# EAGLE design OttoPi02 (EAGLE 9.6.2)
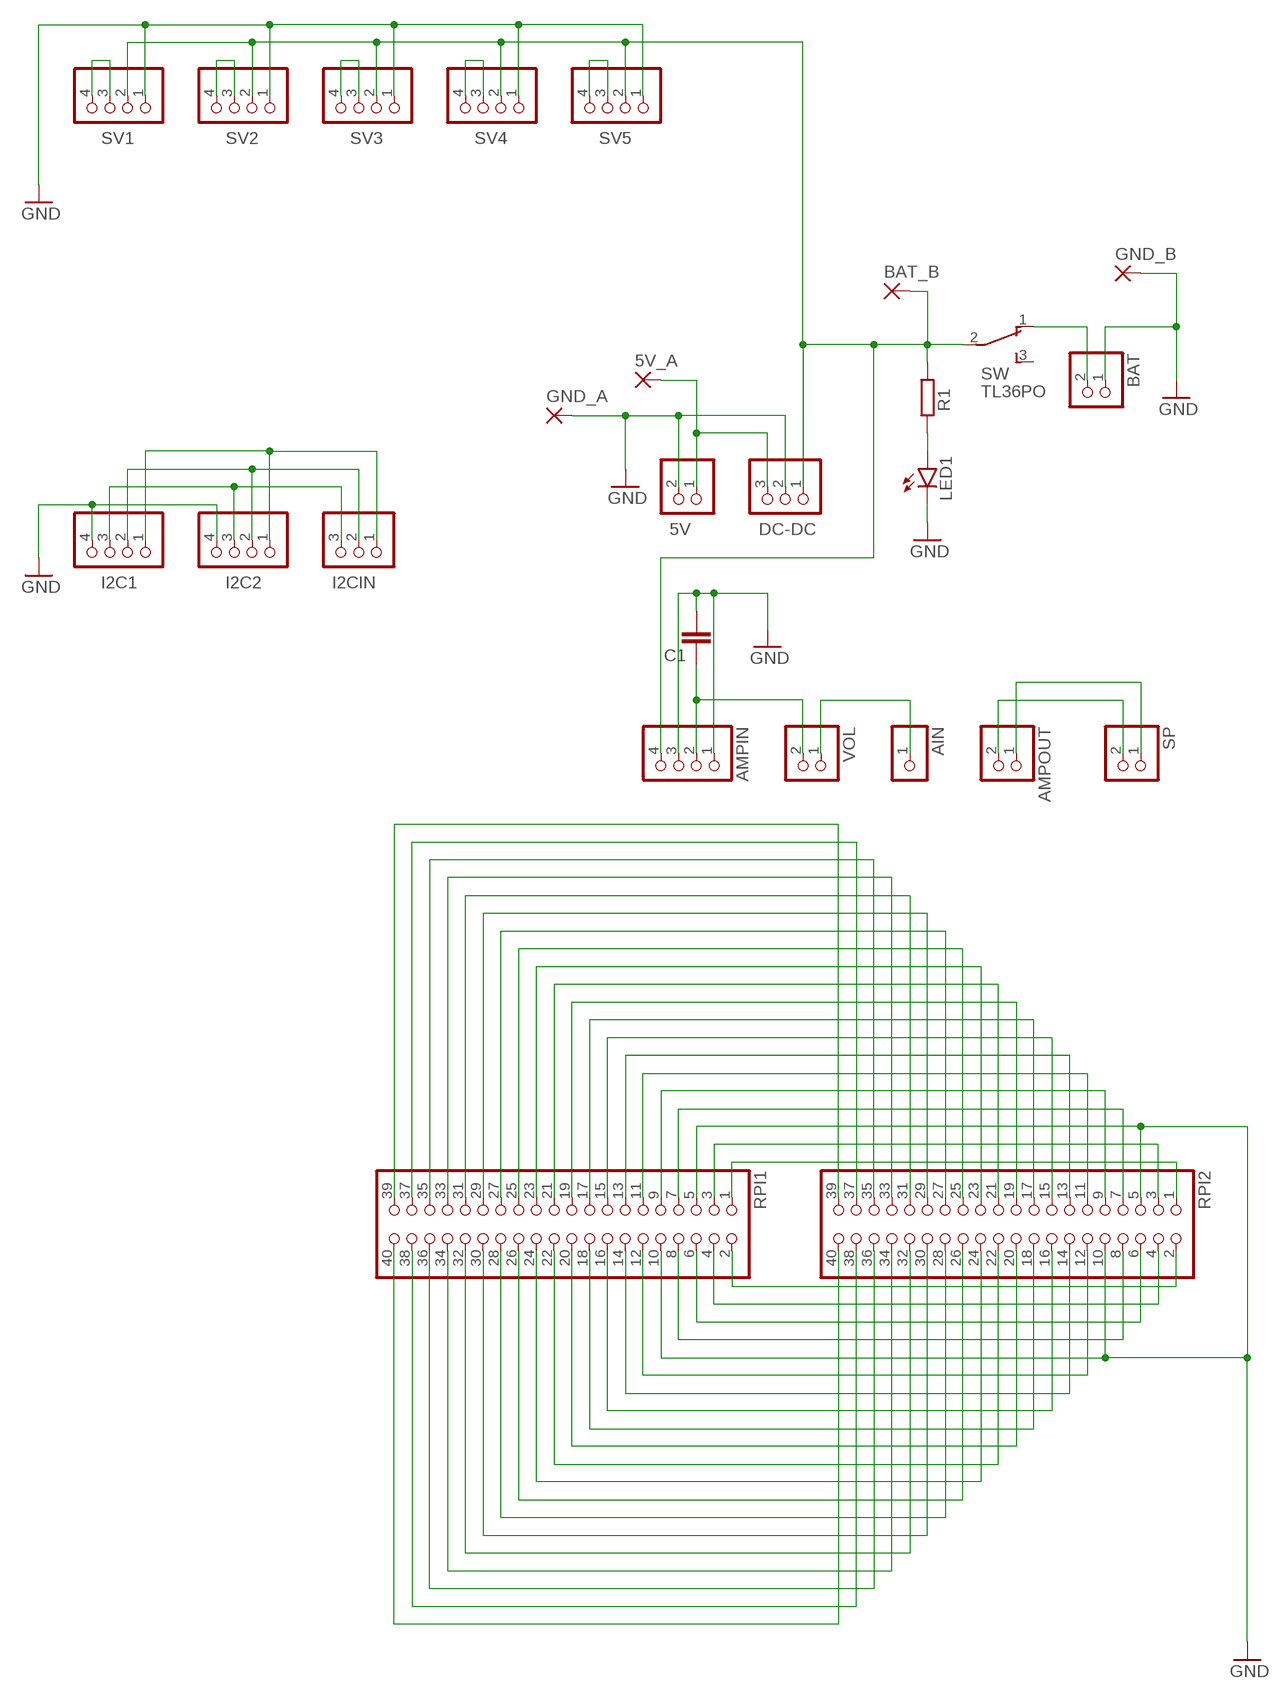
[diagram p0: schematic, sheet 1]

## Parts
5V  PINHD-1X2  [1X02]
5V_A  1,6/0,9  [1,6/0,9]
AIN  PINHD-1X1  [1X01]
AMPIN  PINHD-1X4  [1X04]
AMPOUT  PINHD-1X2  [1X02]
BAT  PINHD-1X2  [1X02]
BAT_B  1,6/0,9  [1,6/0,9]
C1  C-EU025-024X044  [C025-024X044]
DC-DC  PINHD-1X3  [1X03]
GND_A  1,6/0,9  [1,6/0,9]
GND_B  1,6/0,9  [1,6/0,9]
I2C1  PINHD-1X4  [1X04]
I2C2  PINHD-1X4  [1X04]
I2CIN  PINHD-1X3  [1X03]
LED1  LED3MM  [LED3MM]
R1  R-EU_0204/7  [0204/7]
RPI1  PINHD-2X20  [2X20]
RPI2  PINHD-2X20  [2X20]
SP  PINHD-1X2  [1X02]
SV1  PINHD-1X4  [1X04]
SV2  PINHD-1X4  [1X04]
SV3  PINHD-1X4  [1X04]
SV4  PINHD-1X4  [1X04]
SV5  PINHD-1X4  [1X04]
SW  TL36PO  [TL3XPO]
VOL  PINHD-1X2  [1X02]

## Nets
GND: 5V.2 AMPIN.1 AMPIN.3 BAT.1 C1.2 DC-DC.2 GND_A.1(P) GND_B.1(P) I2C1.4 I2C2.4 LED1.K(C) RPI1.5 RPI1.10 RPI2.5 RPI2.10 SV1.1 SV2.1 SV3.1 SV4.1 SV5.1
N$1: I2C1.1 I2C2.1 I2CIN.1
N$2: I2C1.2 I2C2.2 I2CIN.2
N$3: I2C1.3 I2C2.3 I2CIN.3
N$4: AMPOUT.2 SP.2
N$5: 5V.1 5V_A.1(P) DC-DC.3
N$6: SV1.3 SV1.4
N$7: BAT.2 SW.1(O)
N$8: AMPIN.2 C1.1 VOL.2
N$9: SV2.3 SV2.4
N$10: SV3.3 SV3.4
N$11: SV4.3 SV4.4
N$12: AMPOUT.1 SP.1
N$13: AMPIN.4 BAT_B.1(P) DC-DC.1 R1.2 SV1.2 SV2.2 SV3.2 SV4.2 SV5.2 SW.2(P)
N$14: AIN.1 VOL.1
N$15: LED1.A R1.1
N$16: RPI1.1 RPI2.1
N$17: RPI1.3 RPI2.3
N$19: RPI1.7 RPI2.7
N$20: RPI1.9 RPI2.9
N$21: RPI1.11 RPI2.11
N$22: RPI1.13 RPI2.13
N$23: RPI1.15 RPI2.15
N$24: RPI1.17 RPI2.17
N$25: RPI1.19 RPI2.19
N$26: RPI1.21 RPI2.21
N$27: RPI1.23 RPI2.23
N$28: RPI1.25 RPI2.25
N$29: RPI1.27 RPI2.27
N$30: RPI1.29 RPI2.29
N$31: RPI1.31 RPI2.31
N$32: RPI1.33 RPI2.33
N$33: RPI1.35 RPI2.35
N$34: RPI1.37 RPI2.37
N$35: RPI1.39 RPI2.39
N$36: RPI1.2 RPI2.2
N$37: RPI1.4 RPI2.4
N$38: RPI1.6 RPI2.6
N$39: RPI1.8 RPI2.8
N$40: SV5.3 SV5.4
N$41: RPI1.12 RPI2.12
N$42: RPI1.14 RPI2.14
N$43: RPI1.16 RPI2.16
N$44: RPI1.18 RPI2.18
N$45: RPI1.20 RPI2.20
N$46: RPI1.22 RPI2.22
N$47: RPI1.24 RPI2.24
N$48: RPI1.26 RPI2.26
N$49: RPI1.28 RPI2.28
N$50: RPI1.30 RPI2.30
N$51: RPI1.32 RPI2.32
N$52: RPI1.34 RPI2.34
N$53: RPI1.36 RPI2.36
N$54: RPI1.38 RPI2.38
N$55: RPI1.40 RPI2.40
Unconnected: SW.3(S)

## Library data of the parts
5V AMPOUT BAT SP VOL = pinhead:PINHD-1X2: PIN HEADER
5V_A BAT_B GND_A GND_B = wirepad:1,6/0,9: THROUGH-HOLE PAD
AIN = pinhead:PINHD-1X1: PIN HEADER
AMPIN I2C1 I2C2 SV1-SV5 = pinhead:PINHD-1X4: PIN HEADER
C1 = rcl:C-EU: CAPACITOR, European symbol; SPICEPREFIX: C
DC-DC I2CIN = pinhead:PINHD-1X3: PIN HEADER
LED1 = led:LED: LED OSRAM: - CHIPLED LG R971, LG N971, LY N971, LG Q971, LY Q971, LO R971, LY R971 LH N974, LH R974 LS Q976, LO Q976, LY Q976 LO Q996 - Hyper CHIPLED LW Q18S LB Q993, LB Q99A, LB R99A - SideLED LS A670, LO A670, LY A670, LG A670, LP A670 LB A673, LV A673, LT A673, LW A673 LH A674 LY A675 LS A676, LA A676, LO A676, LY A676, LW A676 LS A679, LY A679, LG A679 - Hyper Micro SIDELED® LS Y876, LA Y876, LO Y876, LY Y876 LT Y87S - SmartLED LW L88C, LW L88S LB L89C, LB L89S, LG L890 LS L89K, LO L89K, LY L89K LS L896, LA L896, LO L896, LY L896 - TOPLED LS T670, LO T670, LY T670, LG T670, LP T670 LSG T670, LSP T670, LSY T670, LOP T670, LYG T670 LG T671, LOG T671, LSG T671 LB T673, LV T673, LT T673, LW T673 LH T674 LS T676, LA T676, LO T676, LY T676, LB T676, LH T676, LSB T676, LW T676 LB T67C, LV T67C, LT T67C, LS T67K, LO T67K, LY T67K, LW E67C LS E67B, LA E67B, LO E67B, LY E67B, LB E67C, LV E67C, LT E67C LW T67C LS T679, LY T679, LG T679 LS T770, LO T770, LY T770, LG T770, LP T770 LB T773, LV T773, LT T773, LW T773 LH T774 LS E675, LA E675, LY E675, LS T675 LS T776, LA T776, LO T776, LY T776, LB T776 LHGB T686 LT T68C, LB T68C - Hyper Mini TOPLED® LB M676 - Mini TOPLED Santana® LG M470 LS M47K, LO M47K, LY M47K Source: http://www.osram.convergy.de LUXEON: - LUMILED® LXK2-PW12-R00, LXK2-PW12-S00, LXK2-PW14-U00, LXK2-PW14-V00 LXK2-PM12-R00, LXK2-PM12-S00, LXK2-PM14-U00 LXK2-PE12-Q00, LXK2-PE12-R00, LXK2-PE12-S00, LXK2-PE14-T00, LXK2-PE14-U00 LXK2-PB12-K00, LXK2-PB12-L00, LXK2-PB12-M00, LXK2-PB14-N00, LXK2-PB14-P00, LXK2-PB14-Q00 LXK2-PR12-L00, LXK2-PR12-M00, LXK2-PR14-Q00, LXK2-PR14-R00 LXK2-PD12-Q00, LXK2-PD12-R00, LXK2-PD12-S00 LXK2-PH12-R00, LXK2-PH12-S00 LXK2-PL12-P00, LXK2-PL12-Q00, LXK2-PL12-R00 Source: www.luxeon.com KINGBRIGHT: KA-3528ASYC Source: www.kingbright.com
R1 = rcl:R-EU_: RESISTOR, European symbol; SPICEPREFIX: R
RPI1 RPI2 = pinhead:PINHD-2X20: PIN HEADER
SW = switch:TL36PO: TINY SWITCH ON - ON Source: http://www2.produktinfo.conrad.com/datenblaetter/700000-724999/705152-da-01-de-Subminiaturschalter_TL_36YO.pdf

## Board
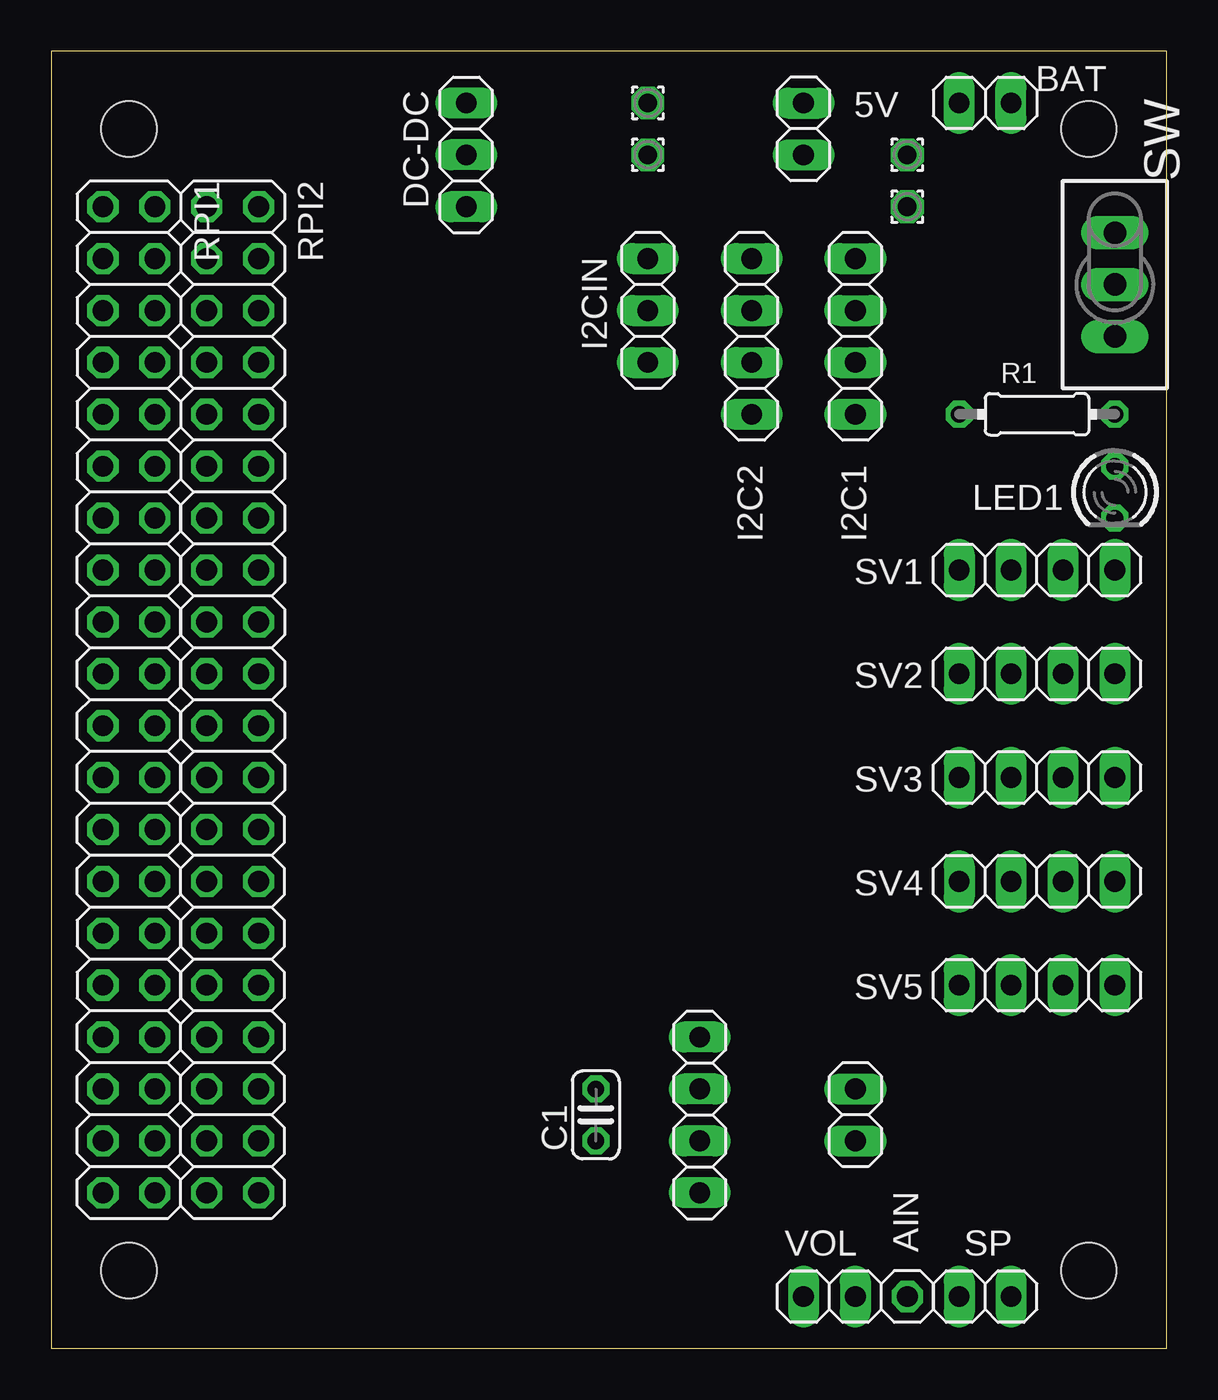
[diagram p1: board, top side]
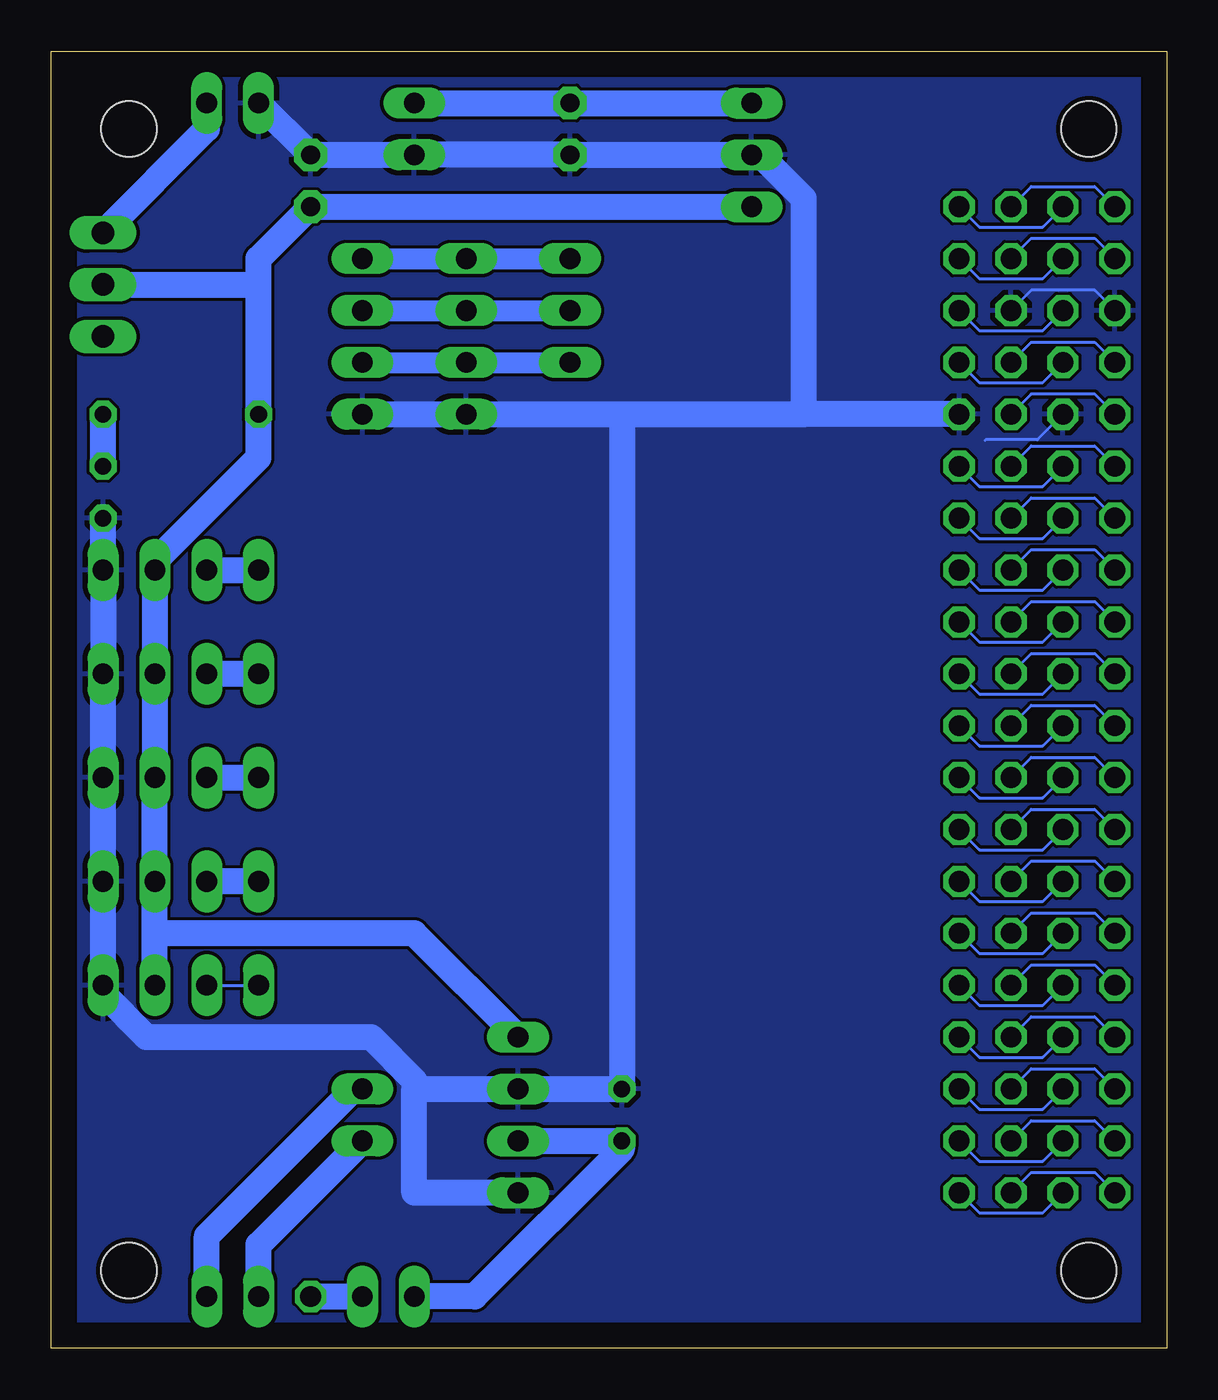
[diagram p2: board, bottom side, seen from below]

Size 54.61 x 63.5 mm. Coordinates in mm from the lower left corner, seen from the top.
Outline: 0,0 54.61,0 54.61,63.5 0,63.5 0,0
Copper layers (1*16): Top 0.035mm / dielectric 1.5mm / Bottom 0.035mm
Design rules "SeeedStudio_2layer_DRU_no_angle_20140221": minimum track width 6mil, minimum drill 12mil, track to track 6mil, track to pad 6mil, pad to pad 6mil, via to via 6mil, smd to smd 0mil, copper to edge 10mil, drill to drill 10mil, minimum pad ring 10mil, minimum via ring 6mil, stop-mask expansion 2mil, vias tented up to drill 100mil, thermal gap 10mil
Holes 2.7 mm at 3.81,3.81 50.8,3.81 3.81,59.69 50.8,59.69

### Footprints (pad centres in the part's own frame; a part is rotated, then mirrored left to right if it is on the bottom)
1X02 = drill 1.016 long: 1 -1.27,0; 2 1.27,0
1,6/0,9 = drill 0.914 pad 1.6 octagon: 1 0,0
1X01 = drill 1.016 octagon: 1 0,0
1X04 = drill 1.016 long: 1 -3.81,0; 2 -1.27,0; 3 1.27,0; 4 3.81,0
C025-024X044 = drill 0.813 octagon: 1 -1.27,0; 2 1.27,0
1X03 = drill 1.016 long: 1 -2.54,0; 2 0,0; 3 2.54,0
LED3MM = drill 0.813 octagon: A -1.27,0; K 1.27,0
0204/7 = drill 0.813 octagon: 1 -3.81,0; 2 3.81,0
2X20 = drill 1.016 octagon: 1 -24.13,-1.27; 2 -24.13,1.27; 3 -21.59,-1.27; 4 -21.59,1.27; 5 -19.05,-1.27; 6 -19.05,1.27; 7 -16.51,-1.27; 8 -16.51,1.27; 9 -13.97,-1.27; 10 -13.97,1.27; 11 -11.43,-1.27; 12 -11.43,1.27; 13 -8.89,-1.27; 14 -8.89,1.27; 15 -6.35,-1.27; 16 -6.35,1.27; 17 -3.81,-1.27; 18 -3.81,1.27; 19 -1.27,-1.27; 20 -1.27,1.27; 21 1.27,-1.27; 22 1.27,1.27; 23 3.81,-1.27; 24 3.81,1.27; 25 6.35,-1.27; 26 6.35,1.27; 27 8.89,-1.27; 28 8.89,1.27; 29 11.43,-1.27; 30 11.43,1.27; 31 13.97,-1.27; 32 13.97,1.27; 33 16.51,-1.27; 34 16.51,1.27; 35 19.05,-1.27; 36 19.05,1.27; 37 21.59,-1.27; 38 21.59,1.27; 39 24.13,-1.27; 40 24.13,1.27
TL3XPO = drill 1.1 pad 1.422 long: 1 -2.54,0; 2 0,0; 3 2.54,0

### Placement (x,y rotation side)
5V  36.83,59.69 270 top
5V_A  29.21,60.96 0 top
AIN  41.91,2.54 270 top
AMPIN  31.75,11.43 90 top
AMPOUT  39.37,11.43 270 top
BAT  45.72,60.96 0 top
BAT_B  41.91,55.88 0 top
C1  26.67,11.43 90 top
DC-DC  20.32,58.42 90 top
GND_A  29.21,58.42 0 top
GND_B  41.91,58.42 0 top
I2C1  39.37,49.53 270 top
I2C2  34.29,49.53 270 top
I2CIN  29.21,50.8 270 top
LED1  52.07,41.91 270 top
R1  48.26,45.72 180 top
RPI1  3.81,31.75 270 top
RPI2  8.89,31.75 270 top
SP  45.72,2.54 180 top
SV1  48.26,38.1 180 top
SV2  48.26,33.02 180 top
SV3  48.26,27.94 180 top
SV4  48.26,22.86 180 top
SV5  48.26,17.78 180 top
SW  52.07,52.07 270 top
VOL  38.1,2.54 180 top

### Tracks (layer width: path | path; a pad name or v marks a point on that pad's centre or on a via)
GND
  Bottom 0.152: RPI1.5 3.53,51.79 6.63,51.79 RPI2.5 | RPI1.10 6.32,44.48 6.35,44.48 8.87,44.48 8.89,44.45
  Bottom 1.27: 26.67,45.72 C1.2 AMPIN.3 36.83,12.7 | 26.67,45.72 17.78,45.72 | LED1.K SV1.1 SV2.1 SV3.1 SV4.1 SV5.1 52.07,17.37 49.94,15.24 38.96,15.24 36.83,13.11 36.83,12.7 | RPI2.10 17.78,45.72 | I2C1.4 I2C2.4 26.67,45.72 | AMPIN.1 36.83,7.62 36.83,12.7 | 17.78,45.72 17.78,56.29 19.91,58.42 DC-DC.2 GND_A.1 5V.2 GND_B.1 BAT.1
  pour Bottom: 1.27,62.23 1.27,1.27 53.34,1.27 53.34,62.23
N$1
  Bottom 1.016: I2CIN.1 I2C2.1 I2C1.1
N$2
  Bottom 1.016: I2CIN.2 I2C2.2 I2C1.2
N$3
  Bottom 1.016: I2CIN.3 I2C2.3 I2C1.3
N$4
  Bottom 1.27: SP.2 44.45,5.08 AMPOUT.2
N$5
  Bottom 1.27: 5V.1 5V_A.1 DC-DC.3
N$6
  Bottom 1.27: SV1.3 SV1.4
N$7
  Bottom 1.27: BAT.2 46.99,59.69 SW.1
N$8
  Bottom 1.27: AMPIN.2 C1.1 26.67,9.75 33.88,2.54 VOL.2
N$9
  Bottom 1.27: SV2.4 SV2.3
N$10
  Bottom 1.27: SV3.3 SV3.4
N$11
  Bottom 1.27: SV4.4 SV4.3
N$12
  Bottom 1.27: SP.1 46.99,5.49 39.78,12.7 AMPOUT.1
N$13
  Bottom 1.27: 44.45,52.07 R1.2 44.45,43.59 49.53,38.51 SV1.2 SV2.2 SV3.2 SV4.2 49.53,20.32 | SV5.2 49.53,20.32 | DC-DC.1 BAT_B.1 44.45,53.34 44.45,52.07 | SW.2 44.45,52.07 | AMPIN.4 36.83,20.32 49.53,20.32
N$14
  Bottom 1.27: AIN.1 VOL.1
N$15
  Bottom 1.27: LED1.A R1.1
N$16
  Bottom 0.152: RPI1.1 3.53,56.87 6.63,56.87 RPI2.1
N$17
  Bottom 0.152: RPI2.3 6.63,54.33 3.53,54.33 RPI1.3
N$19
  Bottom 0.152: RPI2.7 6.63,49.25 3.53,49.25 RPI1.7
N$20
  Bottom 0.152: RPI1.9 3.53,46.71 6.63,46.71 RPI2.9
N$21
  Bottom 0.152: RPI2.11 6.63,44.17 3.53,44.17 RPI1.11
N$22
  Bottom 0.152: RPI1.13 3.53,41.63 6.63,41.63 RPI2.13
N$23
  Bottom 0.152: RPI2.15 6.63,39.09 3.53,39.09 RPI1.15
N$24
  Bottom 0.152: RPI2.17 6.63,36.55 3.53,36.55 RPI1.17
N$25
  Bottom 0.152: RPI2.19 6.63,34.01 3.53,34.01 RPI1.19
N$26
  Bottom 0.152: RPI2.21 6.63,31.47 3.53,31.47 RPI1.21
N$27
  Bottom 0.152: RPI2.23 6.63,28.93 3.53,28.93 RPI1.23
N$28
  Bottom 0.152: RPI1.25 3.53,26.39 6.63,26.39 RPI2.25
N$29
  Bottom 0.152: RPI1.27 3.53,23.85 6.63,23.85 RPI2.27
N$30
  Bottom 0.152: RPI1.29 3.53,21.31 6.63,21.31 RPI2.29
N$31
  Bottom 0.152: RPI2.31 6.63,18.77 3.53,18.77 RPI1.31
N$32
  Bottom 0.152: RPI2.33 6.63,16.23 3.53,16.23 RPI1.33
N$33
  Bottom 0.152: RPI2.35 6.63,13.69 3.53,13.69 RPI1.35
N$34
  Bottom 0.152: RPI2.37 6.63,11.15 3.53,11.15 RPI1.37
N$35
  Bottom 0.152: RPI2.39 6.63,8.61 3.53,8.61 RPI1.39
N$36
  Bottom 0.152: RPI2.2 9.17,54.89 6.07,54.89 RPI1.2
N$37
  Bottom 0.152: RPI1.4 6.07,52.35 9.17,52.35 RPI2.4
N$38
  Bottom 0.152: RPI2.6 9.17,49.81 6.07,49.81 RPI1.6
N$39
  Bottom 0.152: RPI2.8 9.17,47.27 6.07,47.27 RPI1.8
N$40
  Bottom 0.152: SV5.3 SV5.4
N$41
  Bottom 0.152: RPI2.12 9.17,42.19 6.07,42.19 RPI1.12
N$42
  Bottom 0.152: RPI2.14 9.17,39.65 6.07,39.65 RPI1.14
N$43
  Bottom 0.152: RPI2.16 9.17,37.11 6.07,37.11 RPI1.16
N$44
  Bottom 0.152: RPI2.18 9.17,34.57 6.07,34.57 RPI1.18
N$45
  Bottom 0.152: RPI2.20 9.17,32.03 6.07,32.03 RPI1.20
N$46
  Bottom 0.152: RPI2.22 9.17,29.49 6.07,29.49 RPI1.22
N$47
  Bottom 0.152: RPI2.24 9.17,26.95 6.07,26.95 RPI1.24
N$48
  Bottom 0.152: RPI2.26 9.17,24.41 6.07,24.41 RPI1.26
N$49
  Bottom 0.152: RPI2.28 9.17,21.87 6.07,21.87 RPI1.28
N$50
  Bottom 0.152: RPI2.30 9.17,19.33 6.07,19.33 RPI1.30
N$51
  Bottom 0.152: RPI2.32 9.17,16.79 6.07,16.79 RPI1.32
N$52
  Bottom 0.152: RPI2.34 9.17,14.25 6.07,14.25 RPI1.34
N$53
  Bottom 0.152: RPI2.36 9.17,11.71 6.07,11.71 RPI1.36
N$54
  Bottom 0.152: RPI2.38 9.17,9.17 6.07,9.17 RPI1.38
N$55
  Bottom 0.152: RPI2.40 9.17,6.63 6.07,6.63 RPI1.40